# Altium schematic sheet FEV-60_LED_Panel.SchDoc
size B
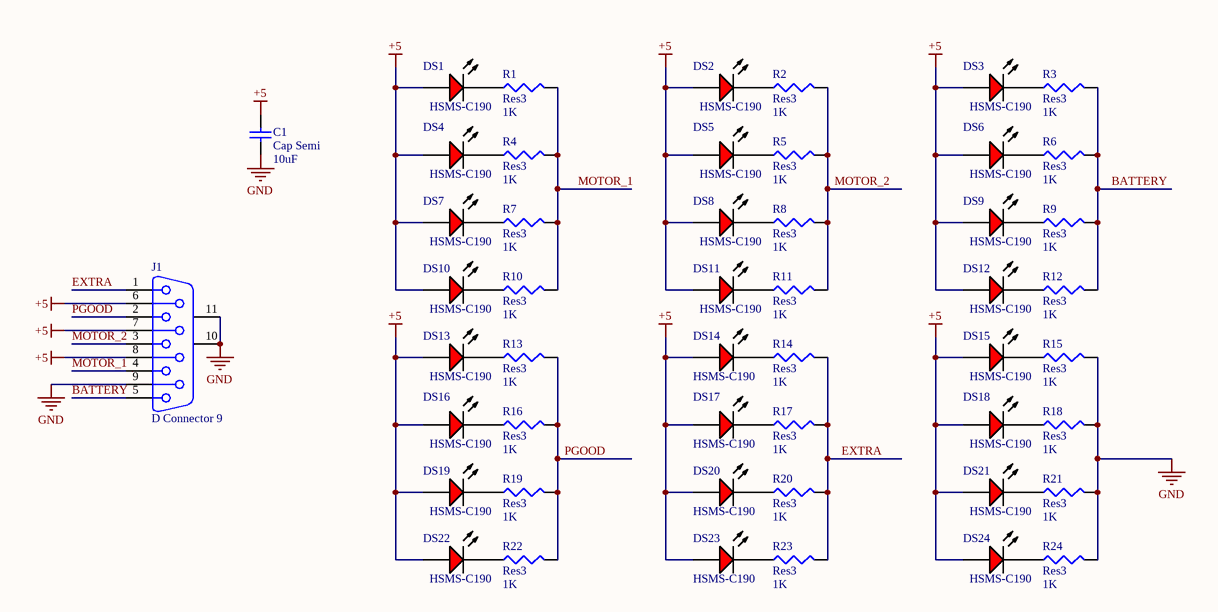
[diagram p0: FEV-60_LED_Panel.SchDoc]

## Parts
C1  Cap Semi  value 10uF  [1608[0603]]
DS1  HSMS-C190  [AVAG-HSMX-C190_V]
DS2  HSMS-C190  [AVAG-HSMX-C190_V]
DS3  HSMS-C190  [AVAG-HSMX-C190_V]
DS4  HSMS-C190  [AVAG-HSMX-C190_V]
DS5  HSMS-C190  [AVAG-HSMX-C190_V]
DS6  HSMS-C190  [AVAG-HSMX-C190_V]
DS7  HSMS-C190  [AVAG-HSMX-C190_V]
DS8  HSMS-C190  [AVAG-HSMX-C190_V]
DS9  HSMS-C190  [AVAG-HSMX-C190_V]
DS10  HSMS-C190  [AVAG-HSMX-C190_V]
DS11  HSMS-C190  [AVAG-HSMX-C190_V]
DS12  HSMS-C190  [AVAG-HSMX-C190_V]
DS13  HSMS-C190  [AVAG-HSMX-C190_V]
DS14  HSMS-C190  [AVAG-HSMX-C190_V]
DS15  HSMS-C190  [AVAG-HSMX-C190_V]
DS16  HSMS-C190  [AVAG-HSMX-C190_V]
DS17  HSMS-C190  [AVAG-HSMX-C190_V]
DS18  HSMS-C190  [AVAG-HSMX-C190_V]
DS19  HSMS-C190  [AVAG-HSMX-C190_V]
DS20  HSMS-C190  [AVAG-HSMX-C190_V]
DS21  HSMS-C190  [AVAG-HSMX-C190_V]
DS22  HSMS-C190  [AVAG-HSMX-C190_V]
DS23  HSMS-C190  [AVAG-HSMX-C190_V]
DS24  HSMS-C190  [AVAG-HSMX-C190_V]
J1  D Connector 9  [DSUB1.385-2H9]
R1  Res3  value 1K  [J1-0603]
R2  Res3  value 1K  [J1-0603]
R3  Res3  value 1K  [J1-0603]
R4  Res3  value 1K  [J1-0603]
R5  Res3  value 1K  [J1-0603]
R6  Res3  value 1K  [J1-0603]
R7  Res3  value 1K  [J1-0603]
R8  Res3  value 1K  [J1-0603]
R9  Res3  value 1K  [J1-0603]
R10  Res3  value 1K  [J1-0603]
R11  Res3  value 1K  [J1-0603]
R12  Res3  value 1K  [J1-0603]
R13  Res3  value 1K  [J1-0603]
R14  Res3  value 1K  [J1-0603]
R15  Res3  value 1K  [J1-0603]
R16  Res3  value 1K  [J1-0603]
R17  Res3  value 1K  [J1-0603]
R18  Res3  value 1K  [J1-0603]
R19  Res3  value 1K  [J1-0603]
R20  Res3  value 1K  [J1-0603]
R21  Res3  value 1K  [J1-0603]
R22  Res3  value 1K  [J1-0603]
R23  Res3  value 1K  [J1-0603]
R24  Res3  value 1K  [J1-0603]

## Nets
+5: C1.2 DS1.1(A) DS2.1(A) DS3.1(A) DS4.1(A) DS5.1(A) DS6.1(A) DS7.1(A) DS8.1(A) DS9.1(A) DS10.1(A) DS11.1(A) DS12.1(A) DS13.1(A) DS14.1(A) DS15.1(A) DS16.1(A) DS17.1(A) DS18.1(A) DS19.1(A) DS20.1(A) DS21.1(A) DS22.1(A) DS23.1(A) DS24.1(A) J1.6 J1.7 J1.8
GND: C1.1 J1.9 J1.10(MH1) J1.11(MH2) R15.2 R18.2 R21.2 R24.2
BATTERY: J1.5 R3.2 R6.2 R9.2 R12.2
EXTRA: J1.1 R14.2 R17.2 R20.2 R23.2
MOTOR_1: J1.4 R1.2 R4.2 R7.2 R10.2
MOTOR_2: J1.3 R2.2 R5.2 R8.2 R11.2
PGOOD: J1.2 R13.2 R16.2 R19.2 R22.2
NetDS1_2: DS1.2(K) R1.1
NetDS2_2: DS2.2(K) R2.1
NetDS3_2: DS3.2(K) R3.1
NetDS4_2: DS4.2(K) R4.1
NetDS5_2: DS5.2(K) R5.1
NetDS6_2: DS6.2(K) R6.1
NetDS7_2: DS7.2(K) R7.1
NetDS8_2: DS8.2(K) R8.1
NetDS9_2: DS9.2(K) R9.1
NetDS10_2: DS10.2(K) R10.1
NetDS11_2: DS11.2(K) R11.1
NetDS12_2: DS12.2(K) R12.1
NetDS13_2: DS13.2(K) R13.1
NetDS14_2: DS14.2(K) R14.1
NetDS15_2: DS15.2(K) R15.1
NetDS16_2: DS16.2(K) R16.1
NetDS17_2: DS17.2(K) R17.1
NetDS18_2: DS18.2(K) R18.1
NetDS19_2: DS19.2(K) R19.1
NetDS20_2: DS20.2(K) R20.1
NetDS21_2: DS21.2(K) R21.1
NetDS22_2: DS22.2(K) R22.1
NetDS23_2: DS23.2(K) R23.1
NetDS24_2: DS24.2(K) R24.1

## Notes on the sheet
- Title
- Date:
- Revision:
- Number:
- Team Skytanic
- Sheet
- of
- Senior Design
- 2019/2020
- File:

## Library data of the parts
C1 = Cap Semi: Capacitor (Semiconductor SIM Model); Published: 8-Jun-2000; LatestRevisionDate: 29-May-2009; LatestRevisionNote: IPC-7351 Footprint Added.; PackageReference: C1206; Publisher: Altium Limited; PackageDescription: Chip Capacitor
DS1-DS24 = CMP-2000-06427-1: LED Uni-Color Red, 52 mW, 20 mA, -40 to 85 degC, 2-Pin SMD, RoHS, Tape and Reel; Manufacturer: Avago; Reverse Voltage: 5V; Viewing Angle: 170deg; High Brightness: No; Lens Type: ColorlessDiffused; DELETED: Compliant; Product Height (mm): 0.8mm; Dominant Wave Length: 626nm; Number of  Elements: 1; Chip Material: GaP; Lum Intensity: 10mcd; Product Length (mm): 1.6mm; Forward Voltage: 2.6V; Power Dissipation: 52W; Shape Type: Rectangular; Forward Current: 25mA; Peak Wavelength: 630nm; Test Current (It): 20mA; Main Category: ChipLED; Lens Dimensions: 1x0.8x0.5mm; Pin Count: 2; Package Reference: HSMX-C190; Mounting Technology: SurfaceMount; Mounting: SurfaceMount; Datasheet URL: http://docs.avagotech.com/docs/AV02-0551EN; Package Type: ChipLed; Operating Temperature Classification: Industrial; Datasheet Version: 03/2012; Operating Temp Range: -40Cto85C; Emitting Color: Red; Rad Hardened: No; Manufacturer URL: http://www.avagotech.com/; Luminous Intensity: 10mcd; Package Description: 2-Pin Surface Mount Device, Body 1.6 x 0.8 mm, Height 0.9 mm; Type: Uni-Color; Packaging: TapeandReel; Product Depth (mm): 0.8mm
J1 = D Connector 9: Receptacle Assembly, 9 Position, Right Angle; PackageDocument: O; Positions: 9; Published: 15-Jun-2001; LatestRevisionDate: 17-Jul-2002; LatestRevisionNote: Re-released for DXP Platform.; DatasheetDocument: 1-Sep-1999; PackageReference: 788750; Publisher: Altium Limited; Orientation: Right Angle; Gender: Receptacle
R1-R24 = Res3: Resistor; Published: 8-Jun-2000; LatestRevisionDate: 29-May-2009; LatestRevisionNote: IPC-7351 Footprint Added.; PackageReference: J1-0603; Publisher: Altium Limited; PackageDescription: Chip Resistor